# EAGLE design CL02 (EAGLE 9.6.2)
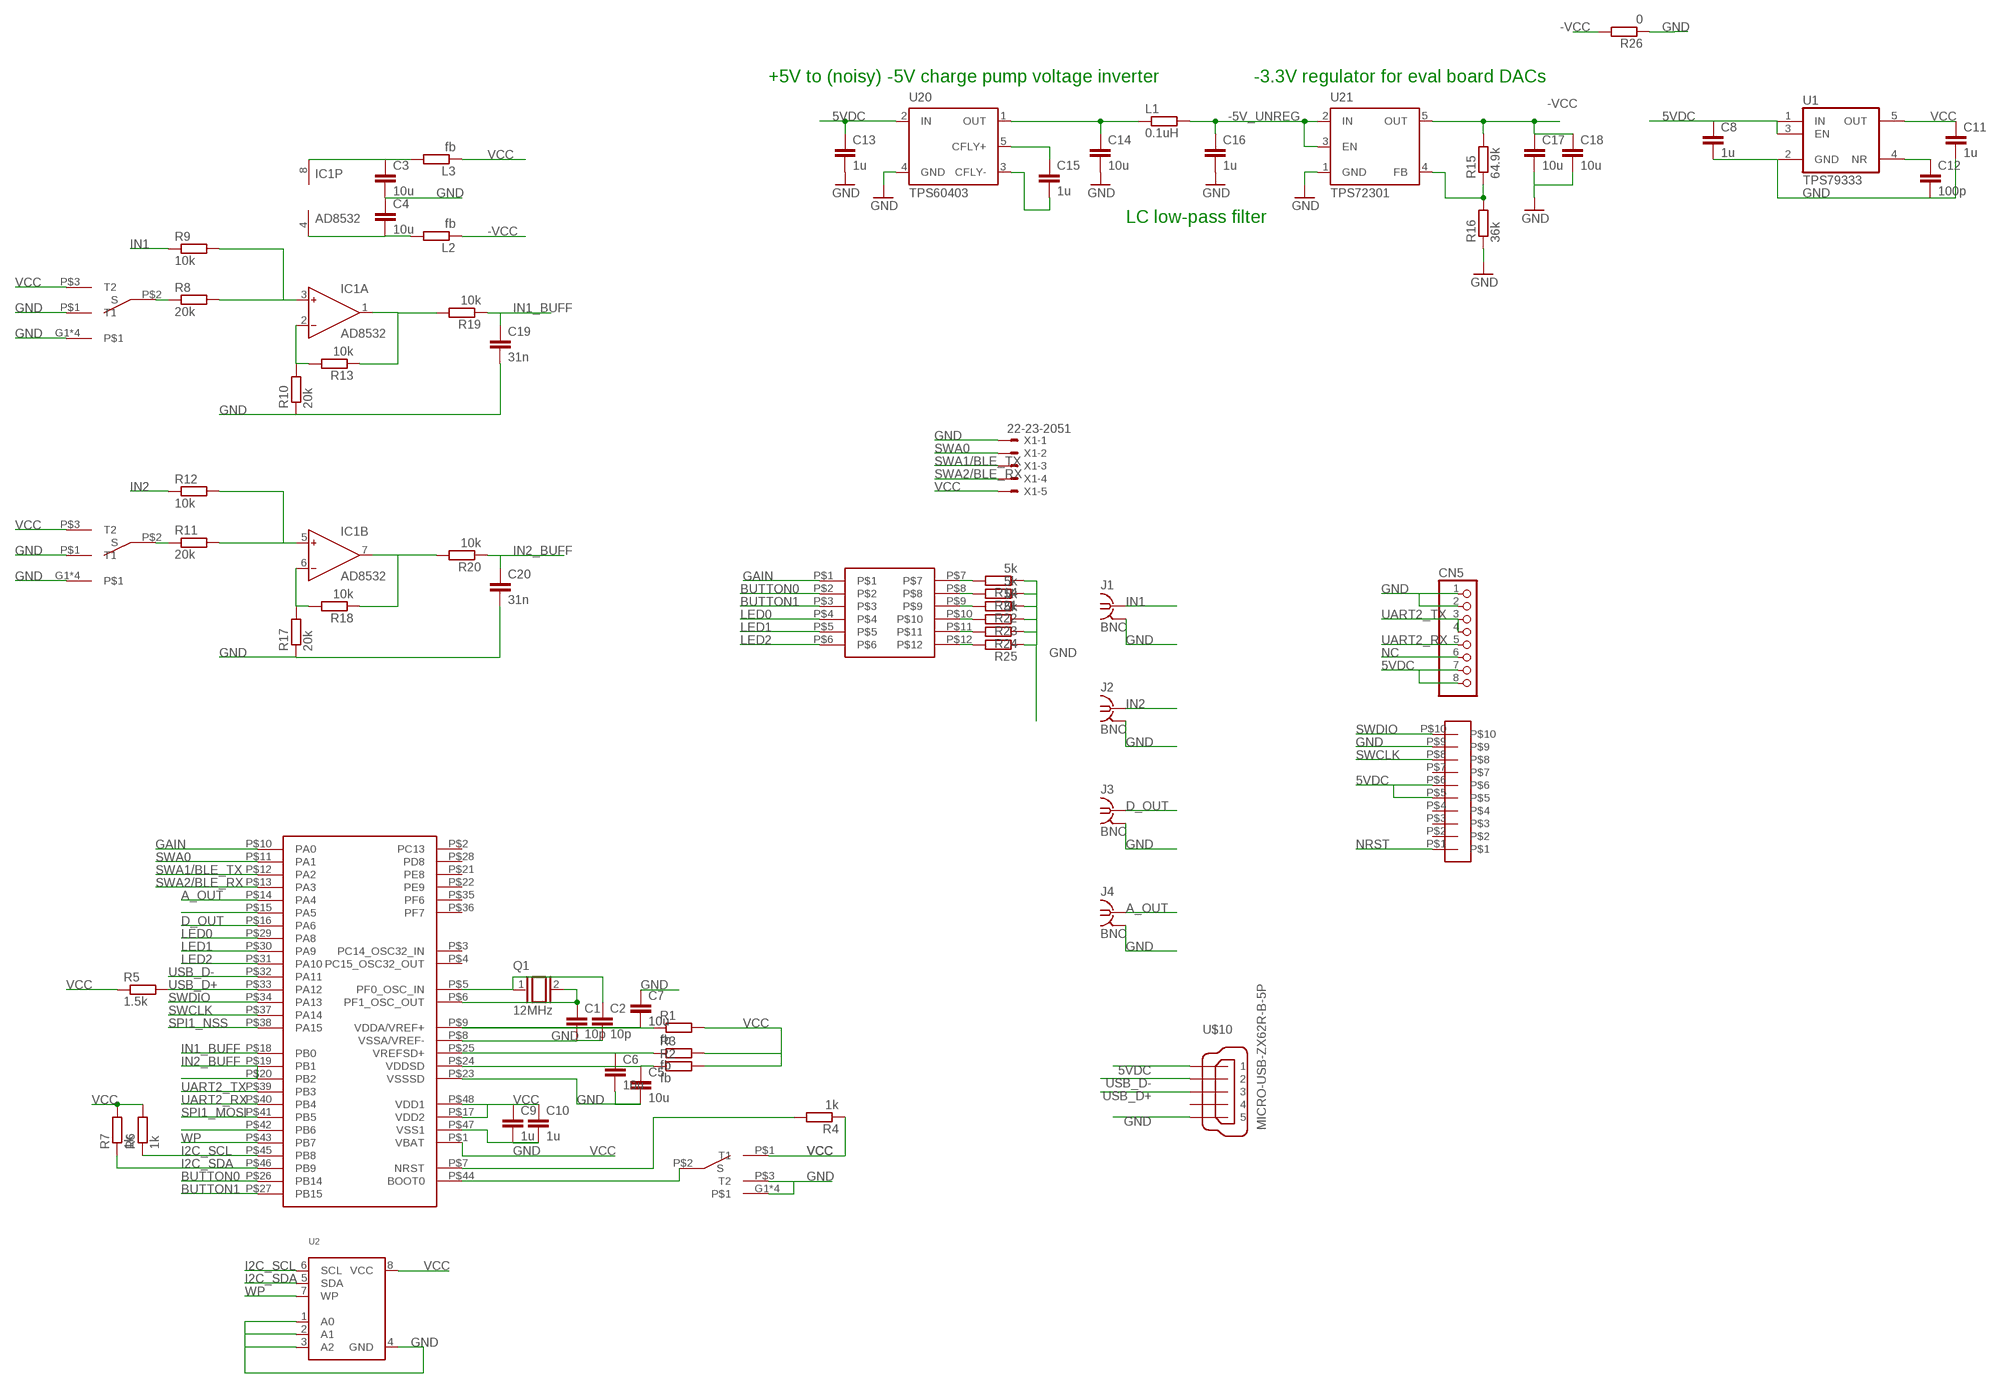
[diagram p0: schematic, sheet 1]

## Parts
C1  10p  CC0402  [C0402]
C2  10p  CC0402  [C0402]
C3  10u  CC0402  [C0402]
C4  10u  CC0402  [C0402]
C5  10u  CC0402  [C0402]
C6  10u  CC0402  [C0402]
C7  10u  CC0402  [C0402]
C8  1u  CC0402  [C0402]
C9  1u  CC0402  [C0402]
C10  1u  CC0402  [C0402]
C11  1u  CC0402  [C0402]
C12  100p  CC0402  [C0402]
C13  1u  CC0402  [C0402]
C14  10u  CC0402  [C0402]
C15  1u  CC0402  [C0402]
C16  1u  CC0402  [C0402]
C17  10u  CC0402  [C0402]
C18  10u  CC0402  [C0402]
C19  31n  CC0402  [C0402]
C20  31n  CC0402  [C0402]
CN5  JST_8PIN  [JSTPH8]
IC1  AD8532  AD8542R  [SO8]
J1  BNC  [BNC-SOCKET]
J2  BNC  [BNC-SOCKET]
J3  BNC  [BNC-SOCKET]
J4  BNC  [BNC-SOCKET]
L1  0.1uH  RR0402  [R0402]
L2  fb  RR0402  [R0402]
L3  fb  RR0402  [R0402]
Q1  12MHz  XTAL/S  [QS]
R1  fb  RR0402  [R0402]
R2  fb  RR0402  [R0402]
R3  fb  RR0402  [R0402]
R4  1k  RR0402  [R0402]
R5  1.5k  RR0402  [R0402]
R6  1k  RR0402  [R0402]
R7  1k  RR0402  [R0402]
R8  20k  RR0402  [R0402]
R9  10k  RR0402  [R0402]
R10  20k  RR0402  [R0402]
R11  20k  RR0402  [R0402]
R12  10k  RR0402  [R0402]
R13  10k  RR0402  [R0402]
R14  5k  RR0402  [R0402]
R15  64.9k  RR0402  [R0402]
R16  36k  RR0402  [R0402]
R17  20k  RR0402  [R0402]
R18  10k  RR0402  [R0402]
R19  10k  RR0402  [R0402]
R20  10k  RR0402  [R0402]
R21  5k  RR0402  [R0402]
R22  5k  RR0402  [R0402]
R23  5k  RR0402  [R0402]
R24  RR0402  [R0402]
R25  RR0402  [R0402]
R26  0  RR0402  [R0402]
U1  TPS79333  [TSOT-23-5]
U2  EEPROM_I2C_SOIC8_GENERIC  [SOIC8_150MIL]
U20  TPS60403  [SOT-23-5]
U21  TPS72301  [SOT-23-5]
U$1  STM32F373CCT6  [LQFP48]
U$6  CUS-12B  [CUS-12B]
U$7  CUS-12B  [CUS-12B]
U$8  2.54MM_2X6  [2.54MM_2X6]
U$9  2.54MM_2X5  [2.54MM_2X5]
U$10  MICRO-USB-ZX62R-B-5P  [ZX62R-B-5P]
U$12  CUS-12B  [CUS-12B]
X1  22-23-2051  [22-23-2051]

## Nets
5VDC: C8.1 C13.1 CN5.7 CN5.8 U1.1(IN) U1.3(EN) U20.2(IN) U$9.P$5 U$9.P$6 U$10.1
-5V_UNREG [power]: C16.1 L1.2 U21.2(IN) U21.3(EN)
-VCC: C17.1 C18.1 L2.1 R15.2 R26.2 U21.5(OUT)
A_OUT: J4.A U$1.P$14(PA4)
BOOT0: U$1.P$44(BOOT0) U$12.P$2(S)
BUTTON0: U$1.P$26(PB14) U$8.P$2
BUTTON1: U$1.P$27(PB15) U$8.P$3
D_OUT: J3.A U$1.P$16(PA6)
GAIN: U$1.P$10(PA0) U$8.P$1
GND: C1.2 C2.2 C3.2 C4.1 C5.2 C6.2 C7.1 C8.2 C9.2 C10.2 C11.2 C12.2 C13.2 C14.2 C16.2 C17.2 C18.2 C19.2 C20.2 CN5.1 CN5.2 J1.SH J2.SH J3.SH J4.SH R10.1 R14.1 R16.1 R17.1 R21.1 R22.1 R23.1 R24.1 R25.1 R26.1 U1.2(GND) U2.1(A0) U2.2(A1) U2.3(A2) U2.4(GND) U20.4(GND) U21.1(GND) U$1.P$8(VSSA/VREF-) U$1.P$23(VSSSD) U$1.P$47(VSS1) U$6.G1 U$6.G2 U$6.G3 U$6.G4 U$6.P$1(T1) U$7.G1 U$7.G2 U$7.G3 U$7.G4 U$7.P$1(T1) U$9.P$9 U$10.5 U$12.G1 U$12.G2 U$12.G3 U$12.G4 U$12.P$3(T2) X1.1
I2C_SCL: R6.1 U2.6(SCL) U$1.P$45(PB8)
I2C_SDA: R7.1 U2.5(SDA) U$1.P$46(PB9)
IN1: J1.A R9.1
IN1_BUFF: C19.1 R19.1 U$1.P$18(PB0)
IN2: J2.A R12.1
IN2_BUFF: C20.1 R20.1 U$1.P$19(PB1) U$1.P$20(PB2)
LED0: U$1.P$29(PA8) U$8.P$4
LED1: U$1.P$30(PA9) U$8.P$5
LED2: U$1.P$31(PA10) U$8.P$6
N$1: C12.1 U1.4(NR)
N$2: IC1.2(A:IN-) R10.2 R13.2
N$3: R25.2 U$8.P$12
N$4: IC1.1(A:OUT) R13.1 R19.2
N$7: C2.1 Q1.1 U$1.P$5(PF0_OSC_IN)
N$8: C1.1 Q1.2 U$1.P$6(PF1_OSC_OUT)
N$9: IC1.3(A:IN+) R8.2 R9.2
N$10: C5.1 R2.1 U$1.P$24(VDDSD)
N$11: C6.1 R3.1 U$1.P$25(VREFSD+)
N$12: C7.2 R1.1 U$1.P$9(VDDA/VREF+)
N$13: R8.1 U$6.P$2(S)
N$14: IC1.6(B:IN-) R17.2 R18.2
N$15: IC1.7(B:OUT) R18.1 R20.2
N$16: IC1.5(B:IN+) R11.2 R12.2
N$17: R11.1 U$7.P$2(S)
N$20: C3.1 IC1.8(P:V+) L3.2
N$21: C4.2 IC1.4(P:V-) L2.2
N$22: R24.2 U$8.P$11
N$23: R23.2 U$8.P$10
N$24: R22.2 U$8.P$9
N$25: R21.2 U$8.P$8
N$26: R14.2 U$8.P$7
N$28: U$1.P$42(PB6)
N$31: U$1.P$15(PA5)
N$145 [power]: C15.1 U20.5(CFLY+)
N$146 [power]: C15.2 U20.3(CFLY-)
N$150: R15.1 R16.2 U21.4(FB)
N$164 [power]: C14.1 L1.1 U20.1(OUT)
NC: CN5.6
NRST: R4.2 U$1.P$7(NRST) U$9.P$1
SPI1_MOSI: U$1.P$41(PB5)
SPI1_NSS: U$1.P$38(PA15)
SWA0: U$1.P$11(PA1) X1.2
SWA1/BLE_TX: U$1.P$12(PA2) X1.3
SWA2/BLE_RX: U$1.P$13(PA3) X1.4
SWCLK: U$1.P$37(PA14) U$9.P$8
SWDIO: U$1.P$34(PA13) U$9.P$10
UART2_RX: CN5.5 U$1.P$40(PB4)
UART2_TX: CN5.3 CN5.4 U$1.P$39(PB3)
USB_D+: R5.2 U$1.P$33(PA12) U$10.3
USB_D-: U$1.P$32(PA11) U$10.2
VCC: C9.1 C10.1 C11.1 L3.1 R1.2 R2.2 R3.2 R4.1 R5.1 R6.2 R7.2 U1.5(OUT) U2.8(VCC) U$1.P$1(VBAT) U$1.P$17(VDD2) U$1.P$48(VDD1) U$6.P$3(T2) U$7.P$3(T2) U$12.P$1(T1) X1.5
WP: U2.7(WP) U$1.P$43(PB7)
Unconnected: U$1.P$2(PC13) U$1.P$3(PC14_OSC32_IN) U$1.P$4(PC15_OSC32_OUT) U$1.P$21(PE8) U$1.P$22(PE9) U$1.P$28(PD8) U$1.P$35(PF6) U$1.P$36(PF7) U$9.P$2 U$9.P$3 U$9.P$4 U$9.P$7 U$10.4

## Notes on the sheet
- +5V to (noisy) -5V charge pump voltage inverter | -3.3V regulator for eval board DACs
- LC low-pass filter

## Library data of the parts
C1-C20 = eagle-ltspice:C: CAPACITOR, European symbol; SPICEMODEL: NONE; SPICEPREFIX: C
CN5 = microbuilder:JST_8PIN: JST 8-Pin Right-Angle Connector
IC1 = analog-devices:AD8542: General-Purpose CMOS Rail-to-Rail Amplifiers Source: http://www.analog.com/static/imported-files/data_sheets/AD8541_8542_8544.pdf; MF: ALTERA CORPORATION; MPN: AD8542ARZ-REEL; OC_FARNELL: 1424150; OC_NEWARK: 59K6827
J1-J4 = INTAN_largeBGA:BNC: BNC Jack (e.g., DigiKey A97555-ND)
L1-L3 R1-R26 = eagle-ltspice:R: RESISTOR, European symbol; SPICEMODEL: NONE; SPICEPREFIX: R
Q1 = special:XTAL/S: CRYSTAL
U1 = harrison:TPS79333
U2 = microbuilder:EEPROM_I2C_SOIC8_GENERIC: Note: The same pinout is used for many I2C EEPROMs in SOIC8(150mil) from a variety of manufacturers and in various sizes. Examples: 16K (2K x 8 Bit) I2C EEPROM 1.7-5.5V, 400KHz, -40°C-85°C Digikey: CAT24C16WI-GT3CT-ND 256K (32K x 8 Bit) I2C EEPROM 1.7-5.5V, 400KHz, -40°C-85°C Digikey: 24AA256-I/SN-ND
U20 = RHD2000_eval_board:TPS60403: Texas Instruments TPS60403 voltage inverter
U21 = RHD2000_eval_board:TPS72301: Texas Instruments TPS62301 adjustable negative regulator
U$1 = HD128:STM32F373CCT6
U$6 U$7 U$12 = HD128:CUS-12B: Toggle Switch
U$8 = HD128:2.54MM_2X6
U$9 = HD128:2.54MM_2X5
U$10 = con-hirose:MICRO-USB-: Hirose Micro USB Connector ZX62R-B-5P: Micro B, reverse (top mount) shell SMT Supplier: DigiKey H11574CT-ND Source: http://www.hirose.co.jp/cataloge_hp/e24200011.pdf
X1 = con-molex:22-23-2051: .100" (2.54mm) Center Header - 5 Pin; MF: MOLEX; MPN: 22-23-2051; OC_FARNELL: 1462952; OC_NEWARK: 38C9178

## Net classes
1 power: width 0.381 mm

## Board
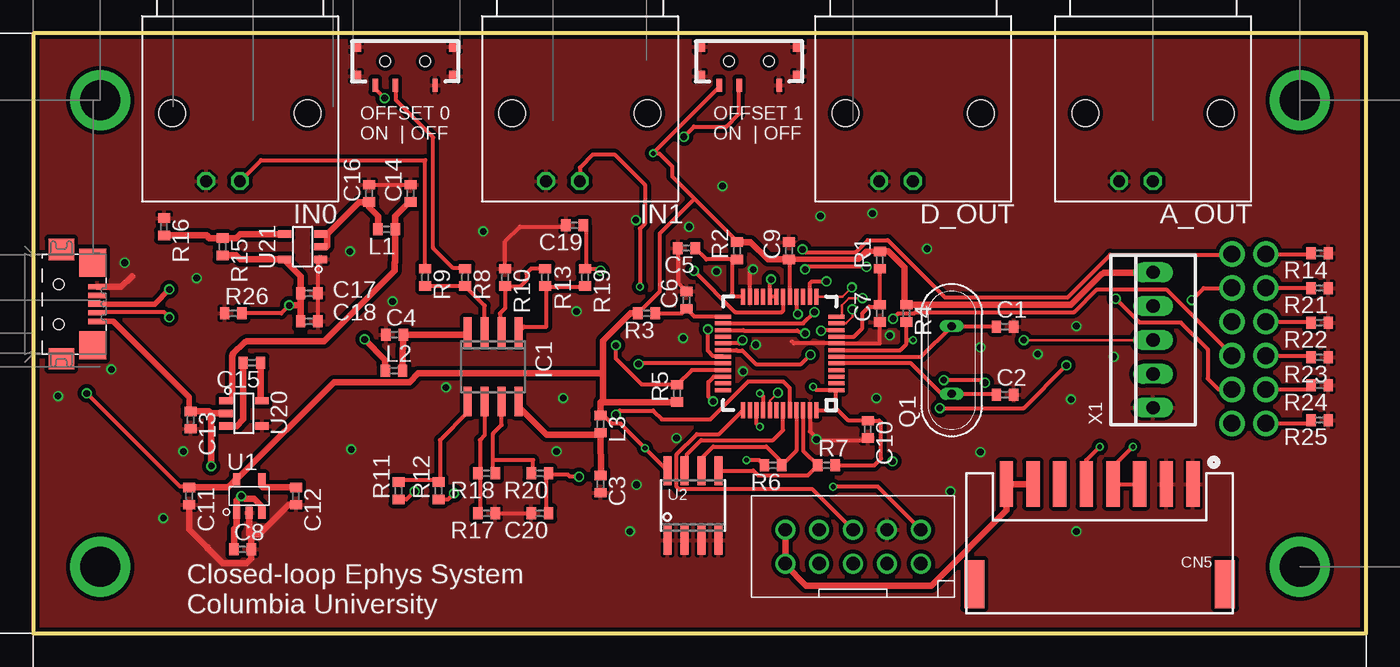
[diagram p1: board, top side]
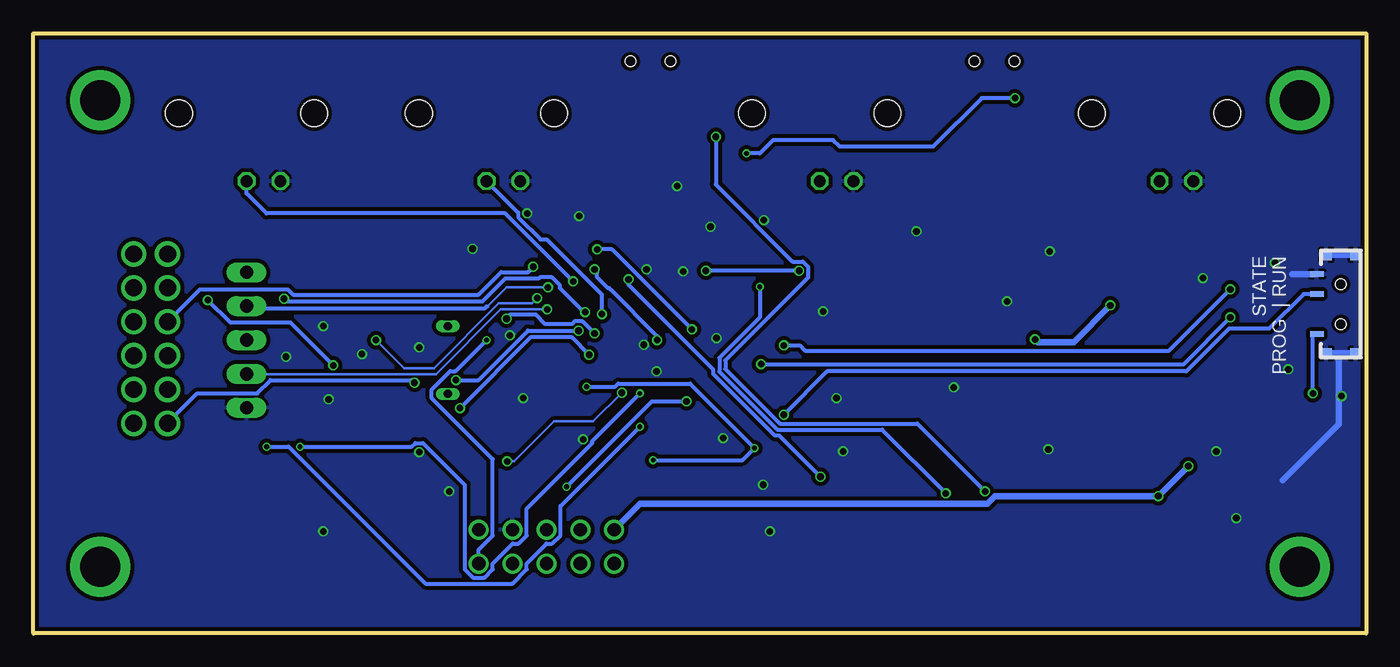
[diagram p2: board, bottom side, seen from below]

Size 100 x 45 mm. Coordinates in mm from the lower left corner, seen from the top.
Outline: 0,45 0,0 100,0 100,45 0,45
Copper layers (1+16): Top 0.012mm / dielectric 0.36mm / Bottom 0.012mm
Design rules "HQPCB_2layers_0.3mm_6mil": minimum track width 0.15mm, minimum drill 0.3mm, track to track 0.15mm, track to pad 0.15mm, pad to pad 0.15mm, via to via 0.15mm, smd to smd 0mil, copper to edge 0.25mm, drill to drill 0.35mm, minimum pad ring 0.125mm, minimum via ring 0.125mm, stop-mask expansion 0mil, vias tented up to drill 0.5mm, thermal gap 0.2mm
Holes 0.6 mm at -33.3,66.1

### Footprints (pad centres in the part's own frame; a part is rotated, then mirrored left to right if it is on the bottom)
C0402 = smd 0.7 x 0.9: 1 -0.65,0; 2 0.65,0
JSTPH8 = smd 1 x 3.4: 1 -7,-3.7; 2 -5,-3.7; 3 -3,-3.7; 4 -1,-3.7; 5 1,-3.7; 6 3,-3.7; 7 5,-3.7; 8 7,-3.7 | smd 1.5 x 3.6: NC1 -9.4,3.8; NC2 9.4,3.8
SO8 = smd 0.6 x 2.2: 1 -1.905,-2.6; 2 -0.635,-2.6; 3 0.635,-2.6; 4 1.905,-2.6; 5 1.905,2.6; 6 0.635,2.6; 7 -0.635,2.6; 8 -1.905,2.6
BNC-SOCKET = drill 0.89 octagon: A 0,-5.08; SH -2.54,-5.08 | hole 2.01: -5.08,0; 5.08,0
R0402 = smd 0.7 x 0.9: 1 -0.65,0; 2 0.65,0
QS = drill 0.61 long: 1 -2.54,0; 2 2.54,0
TSOT-23-5 = smd 0.55 x 0.9: 1 -0.95,-1.25; 2 0,-1.25; 3 0.95,-1.25; 4 0.95,1.25; 5 -0.95,1.25
SOIC8_150MIL = smd 0.6 x 2.2: 1 -1.905,-2.6; 2 -0.635,-2.6; 3 0.635,-2.6; 4 1.905,-2.6; 5 1.905,2.6; 6 0.635,2.6; 7 -0.635,2.6; 8 -1.905,2.6
SOT-23-5 = smd 0.55 x 1: 1 -0.95,-1.35; 2 0,-1.35; 3 0.95,-1.35; 4 0.95,1.35; 5 -0.95,1.35
LQFP48 = smd 1.2 x 0.3: P$1 -4.25,2.75; P$2 -4.25,2.25; P$3 -4.25,1.75; P$4 -4.25,1.25; P$5 -4.25,0.75; P$6 -4.25,0.25; P$7 -4.25,-0.25; P$8 -4.25,-0.75; P$9 -4.25,-1.25; P$10 -4.25,-1.75; P$11 -4.25,-2.25; P$12 -4.25,-2.75; P$25 4.25,-2.75; P$26 4.25,-2.25; P$27 4.25,-1.75; P$28 4.25,-1.25; P$29 4.25,-0.75; P$30 4.25,-0.25; P$31 4.25,0.25; P$32 4.25,0.75; P$33 4.25,1.25; P$34 4.25,1.75; P$35 4.25,2.25; P$36 4.25,2.75 | smd 0.3 x 1.2: P$13 -2.75,-4.25; P$14 -2.25,-4.25; P$15 -1.75,-4.25; P$16 -1.25,-4.25; P$17 -0.75,-4.25; P$18 -0.25,-4.25; P$19 0.25,-4.25; P$20 0.75,-4.25; P$21 1.25,-4.25; P$22 1.75,-4.25; P$23 2.25,-4.25; P$24 2.75,-4.25; P$37 2.75,4.25; P$38 2.25,4.25; P$39 1.75,4.25; P$40 1.25,4.25; P$41 0.75,4.25; P$42 0.25,4.25; P$43 -0.25,4.25; P$44 -0.75,4.25; P$45 -1.25,4.25; P$46 -1.75,4.25; P$47 -2.25,4.25; P$48 -2.75,4.25
CUS-12B = smd 0.8 x 0.8: G1 -3.7,1.1; G2 -3.7,-1.1; G3 3.7,1.1; G4 3.7,-1.1 | smd 0.4 x 1: P$1 -2.25,1.8; P$2 0.75,1.8; P$3 2.25,1.8 | hole 0.8: -1.5,0; 1.5,0
2.54MM_2X6 = drill 1.27: P$1 -6.35,1.27; P$2 -3.81,1.27; P$3 -1.27,1.27; P$4 1.27,1.27; P$5 3.81,1.27; P$6 6.35,1.27; P$7 6.35,-1.27; P$8 3.81,-1.27; P$9 1.27,-1.27; P$10 -1.27,-1.27; P$11 -3.81,-1.27; P$12 -6.35,-1.27
2.54MM_2X5 = drill 1: P$1 -5.08,1.27; P$2 -2.54,1.27; P$3 0,1.27; P$4 2.54,1.27; P$5 5.08,1.27; P$6 5.08,-1.27; P$7 2.54,-1.27; P$8 0,-1.27; P$9 -2.54,-1.27; P$10 -5.08,-1.27
ZX62R-B-5P = smd 1.35 x 0.4: 1 2.675,-1.3; 2 2.675,-0.65; 3 2.675,0; 4 2.675,0.65; 5 2.675,1.3 | smd 1.9 x 1.6: M1 0,-4.1; M2 0,4.1 | smd 2 x 2.1: M3 2.35,3.1; M4 2.35,-3.1
22-23-2051 = drill 1 long: 1 -5.08,0; 2 -2.54,0; 3 0,0; 4 2.54,0; 5 5.08,0

### Placement (x,y rotation side)
C1  72.9,23 0 top
C2  72.9,17.9 0 top
C3  42.55,11.2 270 top
C4  27.1,22.4 0 top
C5  49,28.9 180 top
C6  49,25 90 top
C7  63.5,24 90 top
C8  15.7,6.3 0 top
C9  56.7,28.7 90 top
C10  62.6,15.3 270 top
C11  11.7,10.3 270 top
C12  19.7,10.3 270 top
C13  11.8,16 270 top
C14  28.3,33 90 top
C15  16.4,20.3 180 top
C16  25.2,33 90 top
C17  20.7,25.5 0 top
C18  20.7,23.4 0 top
C19  40.6,30.6 180 top
C20  38,9 180 top
CN5  80,7.5 180 top
IC1  34.5,20 180 top
J1  15.5,39 0 top
J2  41,39 0 top
J3  66,39 0 top
J4  84,39 0 top
L1  26.5,30.3 180 top
L2  27.05,19.7 0 top
L3  42.55,15.7 270 top
Q1  68.9,20.5 90 top
R1  63.5,28 90 top
R2  52.8,28.7 90 top
R3  46,24 180 top
R4  65.5,24 270 top
R5  48.3,18 90 top
R6  55.5,12.6 180 top
R7  59.5,12.6 0 top
R8  32.4,26.7 270 top
R9  29.4,26.7 270 top
R10  35.4,26.7 270 top
R11  27.4,10.7 90 top
R12  30.4,10.7 90 top
R13  38.4,26.7 90 top
R14  96.5,28.5 180 top
R15  14.2,29 270 top
R16  9.8,30.5 270 top
R17  34,9 180 top
R18  34,12 180 top
R19  41.4,26.7 270 top
R20  38,12 180 top
R21  96.5,25.9 180 top
R22  96.5,23.3 180 top
R23  96.5,20.7 180 top
R24  96.5,18.6 180 top
R25  96.5,16 180 top
R26  15,24 0 top
U1  16.2,10.3 0 top
U2  49.5,9.6 0 top
U20  15.8,16.5 270 top
U21  20.2,29 90 top
U$1  56,21 180 top
U$6  27.9,42.9 180 top
U$7  53.7,42.9 180 top
U$8  91.2,22.1 90 top
U$9  61.5,6.5 180 top
U$10  2.1,24.7 0 top
U$12  1.9,24.7 90 bottom
X1  84,22 90 top

### Tracks (layer width: path | path; a pad name or v marks a point on that pad's centre or on a via)
5VDC  (via drill 0.5)
  Top 0.3: 15.25,6.5 C8.1 | 15.3,9.1 U1.1 | 11.95,16.5 C13.1
  Top 0.4: U$10.1 6,23.4 11.7,17.7 11.7,16.75
  Top 0.5: v13.35,12.55 13.35,16.5 | v15.6,10.3 15.7,10.2 | C8.1 15.1,6.55 15.05,6.6 15.05,7.85 15.25,8.05 U1.1 15.25,10 15.4,10.15 v15.6,10.3 | U1.3 17.15,9.5 16.55,10.1 15.9,10.1 v15.6,10.3 | 11.7,16.75 C13.1 13.15,16.65 13.35,16.5 | 13.35,16.5 U20.2 | U$9.P$6 U$9.P$5 56.42,5.14 57.98,3.58 67.36,3.58 73,9.22 CN5.8 CN5.7
  Bottom 0.5: v13.35,12.55 v15.6,10.3 27.85,10.3 28.43,9.72 54.47,9.72 U$9.P$6
-5V_UNREG
  Top 0.5: L1.2 25.85,31.3 25.2,31.95 C16.1 24.45,32.35 22.05,29.95 | 22.05,29.95 U21.3 | 22.05,29.95 22.05,29.05 22,29 U21.2
-VCC  (via drill 0.5)
  Top 0.3: v19.2,24.6 18.6,24 R26.2
  Top 0.5: v24.85,22.05 26.4,20.5 L2.1 | v19.2,24.6 20.05,24.6 | R15.2 15.2,28.35 15.5,28.05 U21.5 19,27.85 20.05,26.8 C17.1 20.05,24.6 | 20.05,24.6 C18.1
  Bottom 0.5: v19.2,24.6 21.95,21.85 24.65,21.85 v24.85,22.05
A_OUT  (via drill 0.5)
  Top 0.3: U$1.P$14 58.25,26.25 58.4,26.4 v59.5,26.4
  Bottom 0.3: v59.5,26.4 64.6,31.5 82.5,31.5 84,33 J4.A
BOOT0  (via drill 0.5)
  Top 0.3: U$1.P$44 56.75,18.4 56.25,18.9 53.65,18.9 50.8,16.05 47.15,16.05 46.5,16.7 44,16.7 v43.7,16.4
  Bottom 0.3: U$12.P$2 4.7,25.45 7.3,22.85 10.3,22.85 13.5,19.65 40.45,19.65 v43.7,16.4
BUTTON0  (via drill 0.5)
  Top 0.3: v81.2,25.1 83,23.3 86.1,23.3 88.1,21.3 88.1,19.1 88.91,18.29 U$8.P$2 | U$1.P$26 57.75,23.25 v58.6,24.1
  Bottom 0.3: v81.2,25.1 81,24.9 66.3,24.9 64.6,26.6 62.1,26.6 62,26.7 61.1,26.7 60.5,26.1 60.5,25.9 58.7,24.1 v58.6,24.1
BUTTON1  (via drill 0.5)
  Top 0.3: U$1.P$27 53.25,22.75 53.3,22.7 57.3,22.7 v57.9,22.5 | v64.5,23.6 64.9,24 66.1,24 66.2,24.1 78.1,24.1 79.8,25.8 85,25.8 89.9,20.9 U$8.P$3
  Bottom 0.3: v64.5,23.6 64.2,23.9 62.3,23.9 61.6,23.2 59.6,23.2 59.4,23.4 58.8,23.4 v57.9,22.5
D_OUT  (via drill 0.5)
  Top 0.3: U$1.P$16 57.25,24 v57.35,23.95
  Bottom 0.3: v57.35,23.95 57.35,25.4 61.5,29.55 61.95,29.55 63.62,31.22 63.62,31.55 J3.A
GAIN  (via drill 0.5)
  Top 0.3: U$1.P$10 59.15,22.75 v59.1,22.7 | v68.3,19 71.2,19 v71.4,18.8
  Bottom 0.3: v59.1,22.7 62.9,22.7 66.6,19 v68.3,19 | v71.4,18.8 71.6,19 82.2,19 83.2,18 87.7,18 89.9,15.8 U$8.P$1
GND  (via drill 0.5)
  Top 0.3: C7.1 63.5,21.75 U$1.P$8 57.05,21.75 56.9,21.9 | C5.2 48.35,26.3 C6.2 | U$1.P$47 58.25,15.15 58.9,14.5 62.45,14.5 C10.2 | 16.3,6.25 C8.2 16.2,6.45 | R10.1 35.4,29.4 36.5,30.5 39.85,30.5 C19.2 | 37.5,9 C20.2 R17.1 34.5,9 | C18.2 C17.2 21.35,27.85 U21.1 | U$1.P$23 53.75,27.05 v54,27.3 | C16.2 C14.2
  Top 0.5: U1.2 16.2,7.45 16.35,7.3 | 16.35,7.3 C8.2 16.35,5.6 16,5.25 14.2,5.25 13.15,6.3 13,6.5 11.7,7.8 C11.2 | C12.2 19.15,9.65 16.95,7.45 16.55,7.45 16.35,7.3 | U$10.5 6.6,26 7.4,26.8
  Bottom 0.5: U$12.G2 U$12.G1 2.15,21 2.05,20.9 2.05,15.7 6.25,11.5 | U$12.G4 U$12.G3 | U$12.P$3 5.55,26.95
  other vias: 26.95,24.9 45.2,31 40.75,24.15 30.95,18.45 23.85,13.8 51.7,33.55 54.2,21.65 68.8,10.65 71.05,13.6 67.05,28.85 62.95,31.5 59.05,31.3 58.75,14.55 64.25,22.35 71.05,21.45 75.35,20.95 78.25,23.05 81.05,20.75 77.85,17.55 5.85,19.8 1.85,17.8 6.85,27.8 49.2,30.5 39.75,17.65 39.25,13.65 48.25,14.65 48.75,22.15 51.25,27.15 53.25,19.65 33.75,30.15 63.25,17.65 45.25,11.15 44.75,7.65 23.75,28.65 12.25,26.65 11.25,13.65 9.75,8.65 78.25,7.65
  pour Top (isolate 0.3): 0.25,44.65 99.65,44.65 99.65,0.35 0.25,0.35
  pour Bottom (isolate 0.3): 0.25,44.65 99.65,44.65 99.65,0.35 0.25,0.35
I2C_SCL
  Top 0.3: U$1.P$45 57.25,13.7 56.27,12.72 | 56.27,12.72 R6.1 | U2.6 50.13,13.13 51,14 55,14 56.27,12.72
I2C_SDA
  Top 0.3: U$1.P$46 57.75,13.7 R7.1 58.1,11.85 54.38,11.85 54.03,12.2 U2.5
IN1
  Top 0.3: R9.1 29.4,27.3 29.3,27.4 29.4,27.5 29.4,35.5 17.08,35.5 J1.A
IN1_BUFF  (via drill 0.5)
  Top 0.3: C19.1 41.5,30.5 41.5,27.5 R19.1 42.4,27.35 v42.55,27.2 | v49.55,27.2 52.65,24.1 56.15,24.1 56.25,24.2 U$1.P$18
  Bottom 0.3: v42.55,27.2 v49.55,27.2
IN2  (via drill 0.35, 0.5)
  Top 0.3: v31.55,10.5 31.1,10.05 R12.1 | v45.5,26 45.5,30.34 45.88,30.72 45.88,33.64 43.59,35.92 42,35.92 41,34.92 J2.A
  Bottom 0.3: v31.55,10.5 36.33,15.28 44.17,15.28 48.52,19.63 48.52,20.67 45.5,23.69 v45.5,26
IN2_BUFF  (via drill 0.5)
  Top 0.3: C20.1 38.5,9 38.5,12 R20.1 38.75,11.9 40.1,11.9 40.25,11.75 v40.95,11.75 | U$1.P$19 U$1.P$20 55.25,26.5 v55.35,26.55
  Bottom 0.3: v55.35,26.55 55.35,26.5 55.35,26.15 48.98,19.77 48.98,19.45 44.35,14.82 44.02,14.82 v40.95,11.75
LED0  (via drill 0.5)
  Top 0.3: v62.5,27.5 58.1,27.5 v57.9,27.3 | U$1.P$29 52.95,21.75 v53.2,22
  Bottom 0.3: v53.2,22 53.2,22.3 56.7,25.8 56.8,25.9 56.9,25.9 57.7,26.7 57.7,27.1 v57.9,27.3 | v62.5,27.5 62.9,27.1 64.9,27.1 66.6,25.4 80.5,25.4 80.9,25.8 87.5,25.8 U$8.P$4
LED1  (via drill 0.5)
  Top 0.3: U$1.P$30 52.75,21.25 52.8,21.2 53.2,21.2 54.2,20.2 57.6,20.2 v58.3,20.9 | v86.9,25 87.8,25.9 89.9,25.9 U$8.P$5 | v77.5,20.1 74.3,16.9 v68,16.9
  Bottom 0.3: v86.9,25 85.2,23.3 80.7,23.3 v77.5,20.1 | v68,16.9 62.7,22.2 59.6,22.2 v58.3,20.9
LED2  (via drill 0.5)
  Top 0.3: v57.7,28.8 57.9,28.6 61.7,28.6 62.6,29.5 64.1,29.5 68.4,25.2 77.6,25.2 80.8,28.4 89.9,28.4 U$8.P$6 | v50.6,22.8 50.6,21.2 51,20.8 51.7,20.8 U$1.P$31
  Bottom 0.3: v57.7,28.8 56.6,28.8 v50.6,22.8
N$1
  Top 0.5: C12.1 17.2,10.95 17.15,11 U1.4
N$2
  Top 0.3: R13.2 37.35,27.35 37,27 37,26.5 36.5,26 35.45,26 R10.2 35.4,24.4 35,24 35,22.73 IC1.2
N$3
  Top 0.3: U$8.P$12 95.6,15.75 R25.2
N$4
  Top 0.3: 38.5,26 38.5,23 36.8,23 IC1.1 | 38.5,26 41,26 R19.2 | 38.5,26 R13.1
N$5  (via drill 3)
  other vias: 5,40
N$6  (via drill 3)
  other vias: 95,40
N$7
  Top 0.3: C2.1 72.19,17.96 Q1.1 68.86,18 68.1,18 65.85,20.25 U$1.P$5
N$8
  Top 0.3: U$1.P$6 66.61,20.75 Q1.2 72.21,23.04 C1.1
N$9
  Top 0.3: R9.2 R8.2 33.87,24.59 IC1.3
N$10
  Top 0.3: C5.1 50.5,28.05 R2.1 52.4,27.95 52.4,25.45 52.6,25.25 U$1.P$24
N$11
  Top 0.3: R3.1 48.65,24 C6.1 49.6,23.75 U$1.P$25
N$12
  Top 0.3: R1.1 C7.2 63.35,24.5 62.7,24.5 62.2,24 62.2,22.9 61.55,22.25 U$1.P$9
N$13
  Top 0.3: U$6.P$2 27.2,41.1 27.2,40 30,37.2 30,28.9 31.5,27.4 32.4,27.4 R8.1
N$14
  Top 0.3: 33.5,12 33.5,14.5 33.87,14.87 IC1.6 | 33.5,12 33.5,9 R17.2 | 33.5,12 R18.2
N$15
  Top 0.3: 34.5,13 34.5,12 R18.1 | R20.2 37.5,12 37.5,13 34.5,13 | 34.5,13 34.5,15 35.13,15.63 IC1.7
N$16
  Top 0.3: R11.2 27.5,11.5 30,11.5 R12.2 30.5,11.5 30.5,14.5 32.59,16.59 IC1.5
N$17  (via drill 0.5)
  Top 0.3: R11.1 28,10.05 v28.6,10.65 | v48.8,37.25 49.55,38 52,38 52.95,38.95 U$7.P$2
  Bottom 0.3: v48.8,37.25 48.8,33.65 43.03,27.88 42.27,27.88 41.88,27.48 41.88,26.68 48.08,20.48 48.08,19.82 43.98,15.72 33.67,15.72 v28.6,10.65
N$18  (via drill 3)
  other vias: 95,5
N$19  (via drill 3)
  other vias: 5,5
N$20
  Top 0.5: C3.1 42.6,11.85 L3.2 42.6,14.9 38.5,14.9 36.41,17 IC1.8
N$21
  Top 0.5: L2.2 27.7,21.35 27.75,21.4 C4.2 30.45,22.4 32.4,22.4 IC1.4
N$22
  Top 0.3: U$8.P$11 95.54,18.29 R24.2
N$23
  Top 0.3: U$8.P$10 95.72,20.83 R23.2
N$24
  Top 0.3: U$8.P$9 95.78,23.37 R22.2
N$25
  Top 0.3: U$8.P$8 R21.2
N$26
  Top 0.3: U$8.P$7 95.8,28.45 R14.2
N$145
  Top 0.5: C15.1 17.05,17.5 17.1,17.45 U20.5
N$146
  Top 0.5: C15.2 15.75,16.05 15.25,15.55 U20.3
N$150
  Top 0.5: U21.4 15.5,29.95 15.2,29.65 R15.1 13.2,29.65 13,29.85 10.1,29.85 10.05,29.8 R16.2
N$164
  Top 0.5: U20.1 14.85,17.45 14.9,17.5 14.9,20.8 15,21 15.8,21.8 16,21.9 21.8,21.9 27.1,27.2 27.1,27.8 27.15,27.85 L1.1 27.15,31.3 28.2,32.35 C14.1
NRST  (via drill 0.35)
  Top 0.3: U$1.P$7 65.05,21.25 65.5,21.7 65.5,22 | 65.5,22 R4.2 | v66,22 65.5,22
  Bottom 0.3: U$9.P$1 66.58,6.29 65.53,7.33 65.53,13.06 70.11,17.65 70.11,18.27 68.71,19.68 68.33,19.68 v66,22
SPI1_MOSI  (via drill 0.5)
  Top 0.2: v55.85,18.05 55.25,17.45 U$1.P$41
  Bottom 0.2: v64.45,12.9 63.95,12.9 60.95,15.9 58,15.9 v55.85,18.05
SWA0  (via drill 0.5)
  Top 0.2: U$1.P$11 60.95,23.25 61.45,23.75 v61.45,24.3
  Bottom 0.2: v61.45,24.3 64.95,24.3 69.8,19.45 X1.2
SWA1/BLE_TX  (via drill 0.5)
  Top 0.2: v74.3,22 X1.3 | v62.2,25.15 61.2,25.15 60.65,24.6 60.65,23.8 60.6,23.75 U$1.P$12
  Bottom 0.2: v74.3,22 72.2,19.9 69.95,19.9 65.1,24.75 62.6,24.75 v62.2,25.15
SWA2/BLE_RX  (via drill 0.5)
  Top 0.2: U$1.P$13 60.7,25.25 v61.4,25.95
  Bottom 0.2: v61.4,25.95 64.5,25.95 65.95,24.5
  Bottom 0.3: 65.95,24.5 66,24.5 66.1,24.4 83.9,24.4 84,24.5 X1.4
SWCLK
  Top 0.3: U$1.P$37 51.45,14.95 49.79,14.95 48.27,13.42 48.27,10.98 48.44,10.8 58.47,10.8 U$9.P$8
SWDIO  (via drill 0.35, 0.5)
  Top 0.3: v51,17.4 50.65,17.75 50.65,18.85 51.05,19.25 U$1.P$34 | U$9.P$10 63.35,11 v60,11
  Bottom 0.3: v60,11 53.6,17.4 v51,17.4
UART2_RX  (via drill 0.35)
  Top 0.3: v80,14 79,13 CN5.5 | v54.5,18 54.75,17.75 U$1.P$40
  Bottom 0.3: v80,14 71.61,14 71.33,14.28 70.77,14.28 67.63,11.13 67.63,4.79 67.02,4.18 66.14,4.18 65.53,4.79 65.53,5.22 64.03,6.72 63.6,6.72 62.99,7.33 62.99,9.36 58.08,14.27 58.08,14.43 v54.5,18
UART2_TX  (via drill 0.35)
  Top 0.3: v54.5,15.5 54.25,15.75 U$1.P$39 | v82.5,14 81,12.5 CN5.4 CN5.3
  Bottom 0.3: v82.5,14 80.85,14 70.58,3.73 64.06,3.73 62.99,4.79 62.99,5.22 61.49,6.72 61.06,6.72 60.45,7.33 60.45,9.55 v54.5,15.5
USB_D+  (via drill 0.5)
  Top 0.3: U$1.P$33 49.4,19.75 R5.2 45.65,18.65 43.7,20.6 v43.7,21.6
  Top 0.4: U$10.3 9.1,24.7 v10.2,25.8
  Bottom 0.3: v43.7,21.6 42.5,21.6 42.1,21.2 14.8,21.2 v10.2,25.8
USB_D-  (via drill 0.5)
  Top 0.3: U$1.P$32 45.4,20.25 v45.4,20.2 | v10.2,23.7 9.8,24.1 4.83,24.1 U$10.2
  Bottom 0.3: v45.4,20.2 13.7,20.2 v10.2,23.7
VCC  (via drill 0.35, 0.5)
  Top 0.3: 60.2,16.9 61.1,16 62.55,16 C10.1 63.45,15.95 63.6,15.8 63.6,13.1 63.1,12.6 R7.2 | 60.2,16.9 60.2,18.2 U$1.P$1 58.75,18.25 v58.5,18.5 | U$1.P$48 60.05,16.75 60.2,16.9 | U1.5 15.2,11.5 | v4,18 11,11 11.5,11 C11.1 | 49.6,32.6 52.65,29.55 R2.2 | 49.6,32.6 47.95,34.25 47.95,35 46.95,36 v46.5,36 51.45,40.95 U$7.P$3 | U$6.P$3 25.65,40.85 v26.35,40.15 | U2.8 v45.9,13.9 44.07,15.72 43.42,15.72 42.8,16.35 L3.1 | U$1.P$17 56.75,28 C9.1 | R6.2 54.45,13 v53.5,13 | R3.2 47,25.65 47,30 49.6,32.6
  Top 0.4: C9.1 61.9,28.05 62.5,28.65 R1.2
  Top 0.5: X1.5 84,27.05 80.3,27.05 80.1,26.9 77.85,24.65 R4.1 65.35,24.85 65.35,27.45 64.15,28.65 R1.2 | C9.1 55.1,28.05 53.8,29.35 R2.2 | 42.75,17.35 42.55,17.35 L3.1 | 42.75,17.35 R5.1 | R3.2 44.8,24 42.75,21.95 42.75,19.5 | 42.75,17.35 42.75,19.5 | C11.1 14.6,10.95 15.05,11.4 U1.5 22.55,18.85 28.22,18.85 28.87,19.5 42.75,19.5
  Bottom 0.3: v4,18 4,22.5 U$12.P$1 | v53.5,13 46.8,13 v45.9,13.9 50.73,18.73 56.13,18.73 56.35,18.5 v58.5,18.5 | v26.35,40.15 28.85,40.15 32.5,36.5 39.5,36.5 40,37 44.5,37 45.5,36 v46.5,36
WP
  Top 0.3: U2.7 49.03,12.37 49.03,13.42 50.11,14.5 55.5,14.5 56.25,15.25 U$1.P$43

### Text on the board
tPlace: OFFSET 0 / ON | OFF | OFFSET 1 / ON | OFF | IN0 | IN1 | D_OUT | A_OUT | Closed-loop Ephys System / Columbia University
bPlace: STATE / PROG | RUN